# EAGLE design BlinkyBoard (EAGLE 7.5.0)
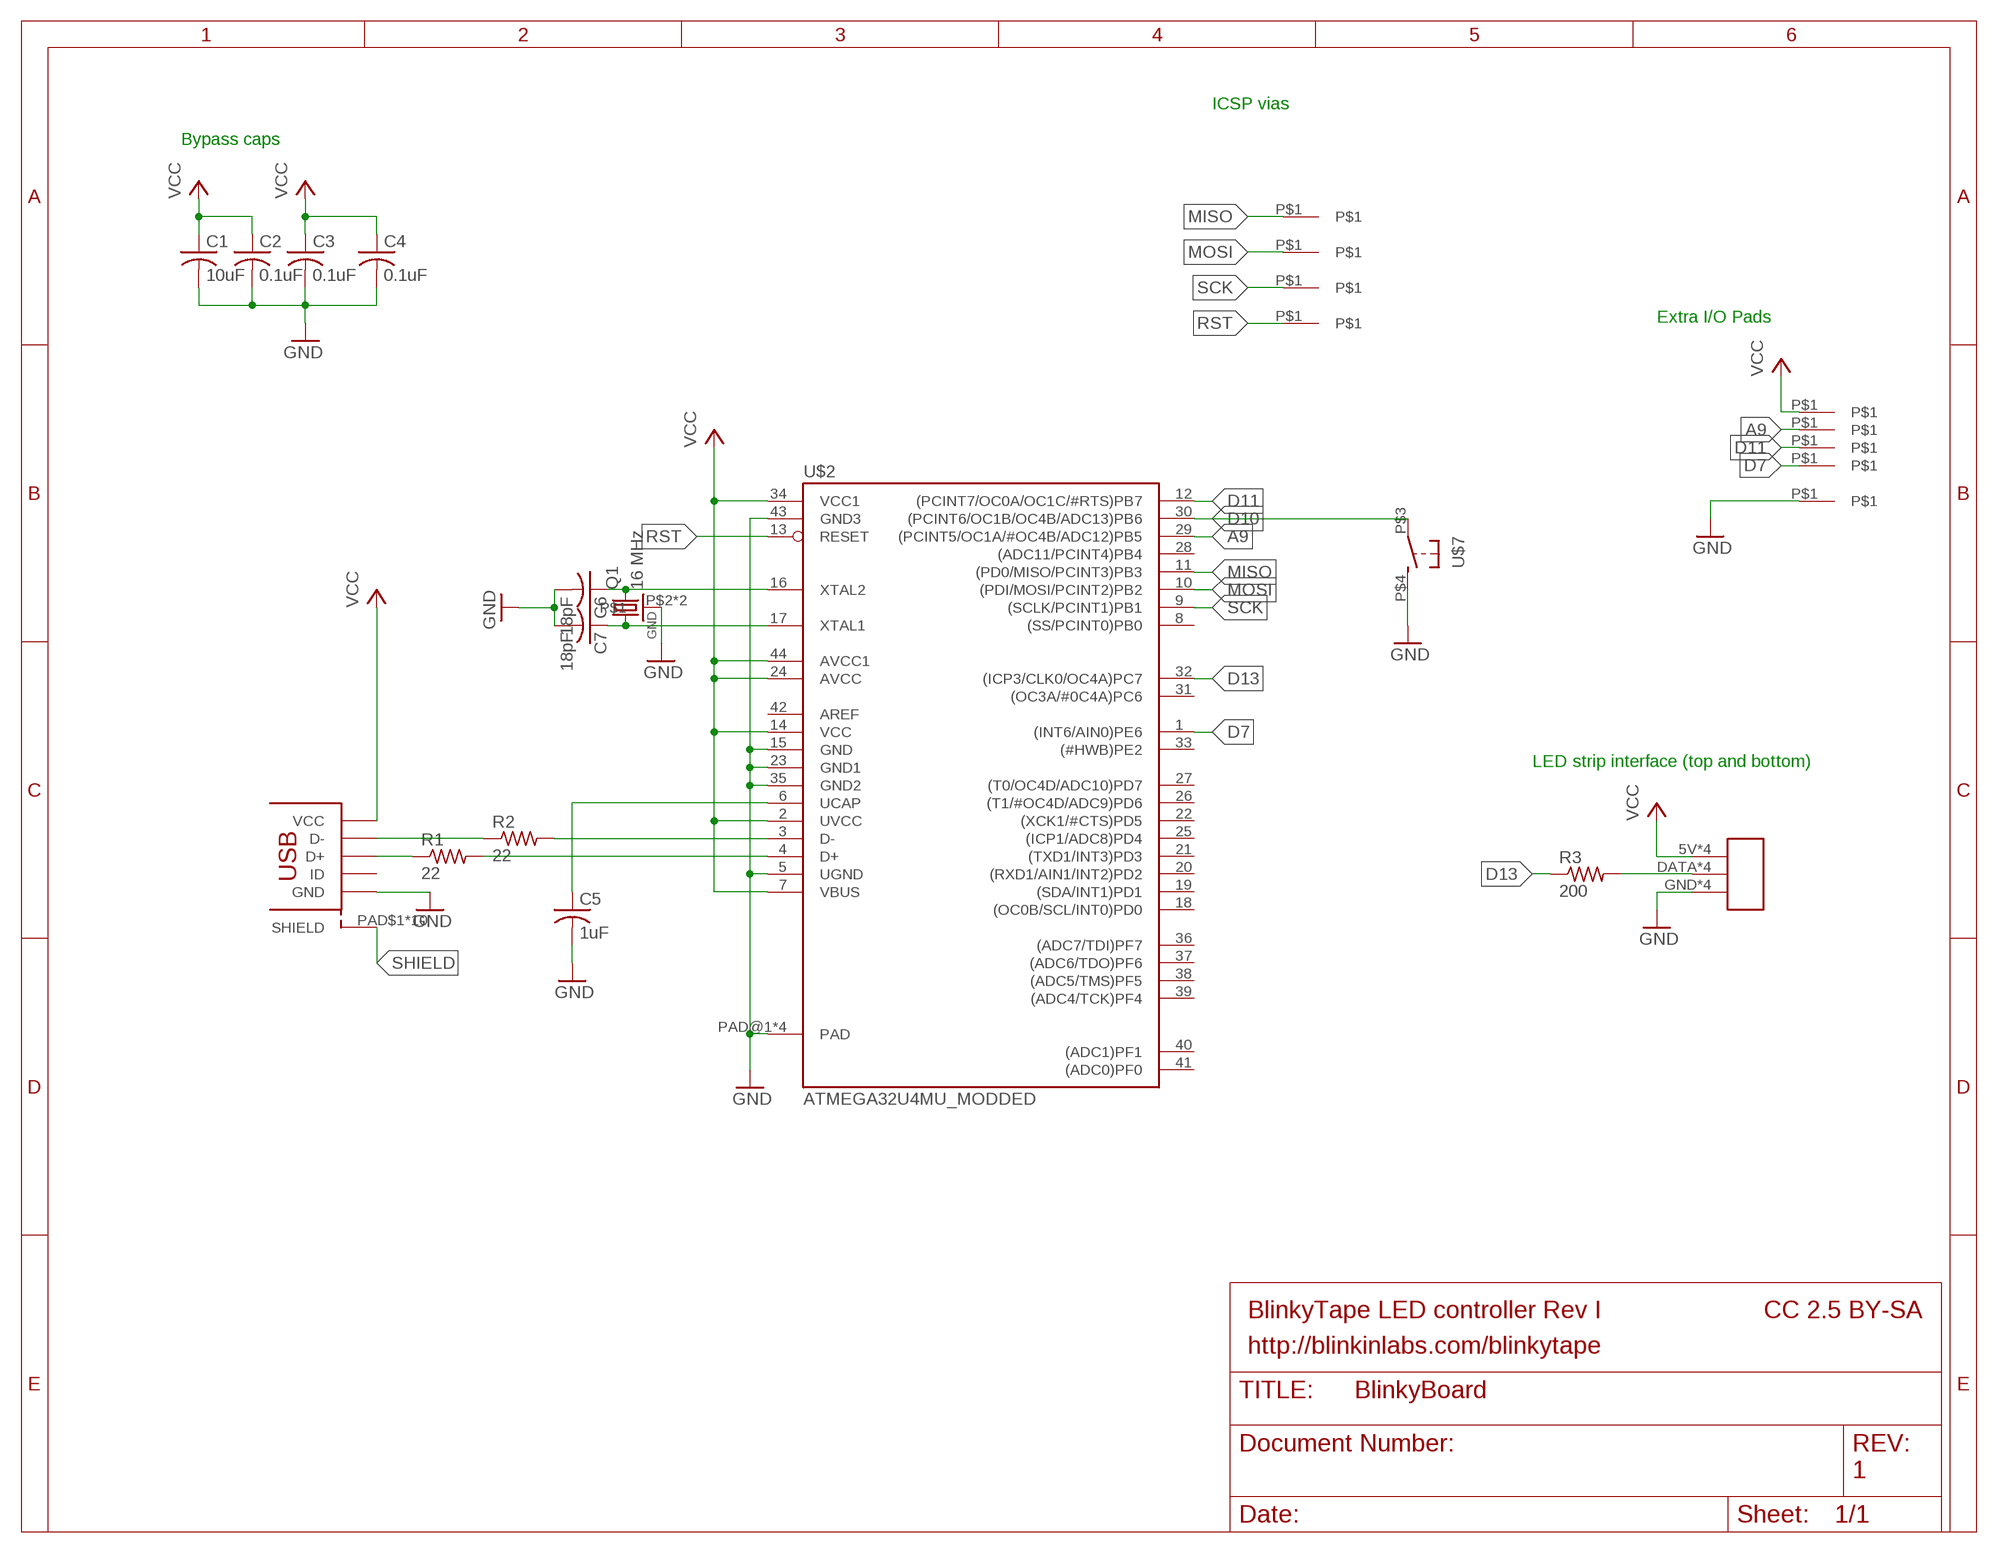
[diagram p0: schematic, sheet 1]

## Parts
C1  10uF  C-USC0603K  [C0603K]
C2  0.1uF  C_US  [CAP_0402_KEMET_MEDIAN]
C3  0.1uF  C_US  [CAP_0402_KEMET_MEDIAN]
C4  0.1uF  C_US  [CAP_0402_KEMET_MEDIAN]
C5  1uF  C_US  [CAP_0402_KEMET_MEDIAN]
C6  18pF  C_US  [CAP_0402_KEMET_MEDIAN]
C7  18pF  C_US  [CAP_0402_KEMET_MEDIAN]
Q1  16 MHz  CRYSTAL_4PAD2520  [CRSYTAL_2520]
R1  22  R_US  [RES_0402_KEMET_MEDIAN]
R2  22  R_US  [RES_0402_KEMET_MEDIAN]
R3  200  R_US  [RES_0402_KEMET_MEDIAN]
U$1  TEST_PAD_SMT  [TEST_PAD_1MM]
U$2  ATMEGA32U4MU_MODDED  [QFN44ML_7X7_LONGLEADS_MOD]
U$3  TEST_PAD_SMT  [TEST_PAD_1MM]
U$4  USB_MICROSMT+THRUHULE  [USB_MICRO_THRUHOLE]
U$5  TEST_PAD_SMT  [TEST_PAD_1MM]
U$6  TEST_PAD_SMT  [TEST_PAD_1MM]
U$7  BUTTON_MOMENTARY  [BUTTON_2P_SMD]
U$9  WS2812B_CONNECTOR  [WS2812B_CONNECTOR]
U$10  TEST_PAD_SMT  [TEST_PAD_SMT]
U$11  TEST_PAD_SMT  [TEST_PAD_SMT]
U$12  TEST_PAD_SMT  [TEST_PAD_SMT]
U$13  TEST_PAD_SMT  [TEST_PAD_SMT]
U$14  TEST_PAD_SMT  [TEST_PAD_SMT]

## Nets
A9: U$2.29((PCINT5/OC1A/#OC4B/ADC12)PB5) U$11.P$1
D7: U$2.1((INT6/AIN0)PE6) U$10.P$1
D10: U$2.30((PCINT6/OC1B/OC4B/ADC13)PB6) U$7.P$3(P)
D11: U$2.12((PCINT7/OC0A/OC1C/#RTS)PB7) U$14.P$1
D13: R3.P$1 U$2.32((ICP3/CLK0/OC4A)PC7)
D+: R1.P$2 U$2.4(D+)
D+_IN: R1.P$1 U$4.PIN$3(D+)
D-: R2.P$2 U$2.3(D-)
D-_IN: R2.P$1 U$4.PIN$2(D-)
GND [power]: C1.2 C2.P$2 C3.P$2 C4.P$2 C5.P$2 C6.P$2 C7.P$2 Q1.P$2 Q1.P$4 U$2.5(UGND) U$2.15(GND) U$2.23(GND1) U$2.35(GND2) U$2.43(GND3) U$2.PAD@1(PAD) U$2.PAD@4(PAD) U$2.PAD@13(PAD) U$2.PAD@16(PAD) U$4.PIN$5(GND) U$7.P$4(S) U$9.GND U$9.GND1(GND) U$9.GND_1(GND) U$9.GND_2(GND) U$13.P$1
LED_DATA: R3.P$2 U$9.DATA U$9.DATA1(DATA) U$9.DATA_1(DATA) U$9.DATA_2(DATA)
MISO: U$1.P$1 U$2.11((PD0/MISO/PCINT3)PB3)
MOSI: U$2.10((PDI/MOSI/PCINT2)PB2) U$3.P$1
N$2: C5.P$1 U$2.6(UCAP)
N$8: C6.P$1 Q1.P$3 U$2.16(XTAL2)
N$9: C7.P$1 Q1.P$1 U$2.17(XTAL1)
RST: U$2.13(RESET) U$6.P$1
SCK: U$2.9((SCLK/PCINT1)PB1) U$5.P$1
SHIELD: U$4.PAD$1(SHIELD) U$4.PAD$2(SHIELD) U$4.PAD$3(SHIELD) U$4.PAD$4(SHIELD) U$4.PAD$5(SHIELD) U$4.PAD$6(SHIELD) U$4.PAD$7(SHIELD) U$4.PAD$8(SHIELD) U$4.PAD$9(SHIELD) U$4.PAD$10(SHIELD)
VCC [power]: C1.1 C2.P$1 C3.P$1 C4.P$1 U$2.2(UVCC) U$2.7(VBUS) U$2.14(VCC) U$2.24(AVCC) U$2.34(VCC1) U$2.44(AVCC1) U$4.PIN$1(VCC) U$9.5V U$9.5V1(5V) U$9.5V_1(5V) U$9.5V_2(5V) U$12.P$1
Unconnected: U$2.8((SS/PCINT0)PB0) U$2.18((OC0B/SCL/INT0)PD0) U$2.19((SDA/INT1)PD1) U$2.20((RXD1/AIN1/INT2)PD2) U$2.21((TXD1/INT3)PD3) U$2.22((XCK1/#CTS)PD5) U$2.25((ICP1/ADC8)PD4) U$2.26((T1/#OC4D/ADC9)PD6) U$2.27((T0/OC4D/ADC10)PD7) U$2.28((ADC11/PCINT4)PB4) U$2.31((OC3A/#0C4A)PC6) U$2.33((#HWB)PE2) U$2.36((ADC7/TDI)PF7) U$2.37((ADC6/TDO)PF6) U$2.38((ADC5/TMS)PF5) U$2.39((ADC4/TCK)PF4) U$2.40((ADC1)PF1) U$2.41((ADC0)PF0) U$4.PIN$4(ID)

## Notes on the sheet
- ICSP vias
- Bypass caps
- Extra I/O Pads
- LED strip interface (top and bottom)
- BlinkyTape LED controller Rev I | CC 2.5 BY-SA
- http://blinkinlabs.com/blinkytape
- 1

## Power pins joined to a net without a drawn wire
AREF: U$2.42(AREF)

## Library data of the parts
C1 = adafruit:C-US: CAPACITOR, American symbol
C2-C7 = blinkiverse:C_US
Q1 = blinkinlabs:CRYSTAL_4PAD
R1-R3 = blinkiverse:R_US
U$1 U$3 U$5 U$6 = blinkinlabs:TEST_PAD_SMT
U$2 = blinkinlabs:ATMEGA32U4
U$4 = blinkinlabs:USB_MICRO
U$7 = blinkinlabs:BUTTON_MOMENTARY
U$9 = blinkiverse:WS2812B_CONNECTOR
U$10-U$14 = blinkiverse:TEST_PAD_SMT

## Net classes
0 data: width 0.2 mm, drill 0.3 mm, clearance 0.2 mm
1 power: width 0.24 mm, drill 0.3 mm, clearance 0.2 mm

## Board
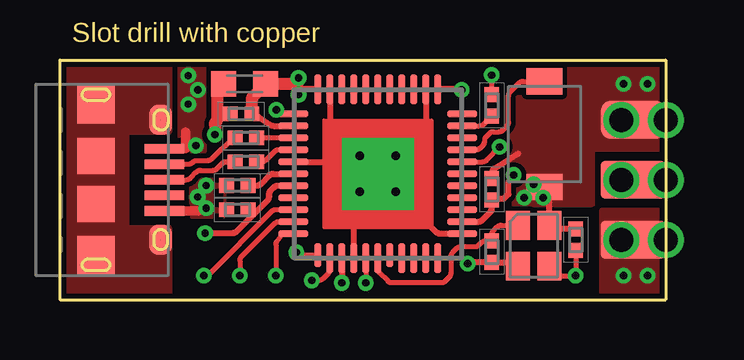
[diagram p1: board, top side]
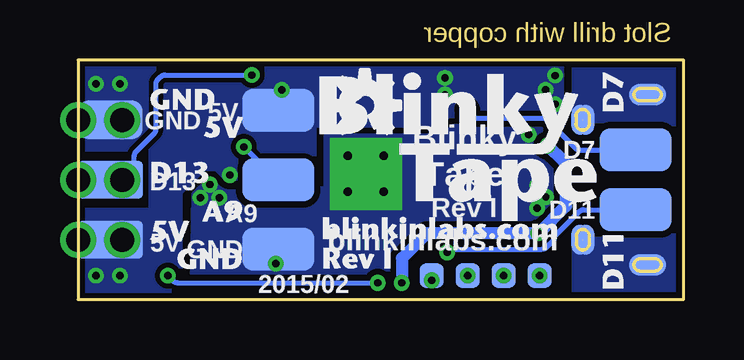
[diagram p2: board, bottom side, seen from below]

Size 25.25 x 10 mm. Coordinates in mm from the lower left corner, seen from the top.
Outline: 0,0 0,10 25.25,10 25.25,0 0,0
Copper layers (1*16): Top 0.0356mm / dielectric 1.5011mm / Bottom 0.0356mm
Design rules "BlinkyTape *": minimum track width 0.2mm, minimum drill 0.3mm, track to track 0.2mm, track to pad 0.2mm, pad to pad 0.2mm, via to via 0.2mm, smd to smd 0.2mm, copper to edge 8mil, drill to drill 0.25mm, minimum pad ring 7mil, minimum via ring 7mil, stop-mask expansion 2mil, vias tented up to drill 0.3mm, thermal gap 10mil

### Footprints (pad centres in the part's own frame; a part is rotated, then mirrored left to right if it is on the bottom)
C0603K = smd 1.05 x 1.08: 1 -0.875,0; 2 0.875,0
CAP_0402_KEMET_MEDIAN = smd 0.62 x 0.62: P$1 -0.45,0; P$2 0.45,0
CRSYTAL_2520 = smd 1.2 x 1: P$1 -0.85,-0.65; P$2 0.85,-0.65; P$3 0.85,0.65; P$4 -0.85,0.65
RES_0402_KEMET_MEDIAN = smd 0.62 x 0.62: P$1 -0.45,0; P$2 0.45,0
TEST_PAD_1MM = smd 1 x 1: P$1 0,0
QFN44ML_7X7_LONGLEADS_MOD = smd 1.25 x 0.275: 1 -3.525,2.5; 2 -3.525,2; 3 -3.525,1.5; 4 -3.525,1; 5 -3.525,0.5; 6 -3.525,0; 7 -3.525,-0.5; 8 -3.525,-1; 9 -3.525,-1.5; 10 -3.525,-2; 11 -3.525,-2.5; 23 3.525,-2.5; 24 3.525,-2; 25 3.525,-1.5; 26 3.525,-1; 27 3.525,-0.5; 28 3.525,0; 29 3.525,0.5; 30 3.525,1; 31 3.525,1.5; 32 3.525,2; 33 3.525,2.5 | smd 0.275 x 1: 12 -2.5,-3.4; 18 0.5,-3.4 | smd 0.275 x 1.25: 13 -2,-3.525; 14 -1.5,-3.525; 15 -1,-3.525; 16 -0.5,-3.525; 17 0,-3.525; 19 1,-3.525; 20 1.5,-3.525; 21 2,-3.525; 22 2.5,-3.525; 34 2.5,3.525; 35 2,3.525; 36 1.5,3.525; 37 1,3.525; 38 0.5,3.525; 39 0,3.525; 40 -0.5,3.525; 41 -1,3.525; 42 -1.5,3.525; 43 -2,3.525; 44 -2.5,3.525 | drill 0.35 pad 1.5 square: PAD@1 -0.75,0.75; PAD@4 0.75,0.75; PAD@13 -0.75,-0.75; PAD@16 0.75,-0.75
USB_MICRO_THRUHOLE = smd 1.645 x 1.55: PAD$1 -3.172,0; PAD$4 3.172,0 | smd 1.5 x 1.55: PAD$2 -1,0; PAD$3 1,0 | smd 1.25 x 0.95: PAD$5 -2.5,2.7; PAD$6 2.5,2.7 | smd 0.9 x 1.55 bottom: PAD$7 -3.55,0; PAD$8 3.55,0 | smd 1.25 x 0.95 bottom: PAD$9 -2.5,2.7; PAD$10 2.5,2.7 | smd 0.4 x 1.65: PIN$1 -1.3,2.85; PIN$2 -0.65,2.85; PIN$3 0,2.85; PIN$4 0.65,2.85; PIN$5 1.3,2.85
BUTTON_2P_SMD = smd 1.1 x 1.5: P$3 -2.2,0; P$4 2.2,0
WS2812B_CONNECTOR = smd 2.7 x 1.6 bottom: 5V 0,2.5; DATA1 0,0; GND1 0,-2.5 | smd 2.7 x 1.6: 5V1 0,2.5; DATA 0,0; GND 0,-2.5 | drill 1: 5V_1 1.35,2.5; 5V_2 -0.5,2.5 | drill 1 pad 1.5: DATA_1 1.35,0; DATA_2 -0.5,0; GND_1 1.35,-2.5; GND_2 -0.5,-2.5
TEST_PAD_SMT = smd 1.8 x 3: P$1 0,0

### Placement (x,y rotation side)
C1  7.7,9 180 top
C2  7.55,7.75 180 top
C3  7.4,3.75 180 top
C4  18,4.6 90 top
C5  7.4,4.76 180 top
C6  21.5,2.5 90 top
C7  18,2 270 top
Q1  19.75,2.25 270 top
R1  7.75,5.75 0 top
R2  7.75,6.75 0 top
R3  18,8.1 90 top
U$1  9,1 0 bottom
U$2  13.25,5.25 0 top
U$3  7.5,1 0 bottom
U$4  1.5,5 270 top
U$5  6,1 0 bottom
U$6  10.5,1 0 bottom
U$7  20.2,6.9 270 top
U$9  23.9,5 180 bottom
U$10  2,6.25 90 bottom
U$11  16.9,5 90 bottom
U$12  16.9,7.9 270 bottom
U$13  16.9,2.1 270 bottom
U$14  2,3.75 270 bottom
U$15  [OSHW-LOGO-S]  13.29,8.1 0 bottom

### Tracks (layer width: path | path; a pad name or v marks a point on that pad's centre or on a via)
A9  (via drill 0.3)
  Top 0.2: U$2.29 17.61,5.75 arc45 17.79,5.83 v18.33,6.37
  Bottom 0.2: U$11.P$1 16.97,5 v18.33,6.37
D7  (via drill 0.3)
  Top 0.2: U$2.1 9.29,7.75 v9.02,7.92
  Bottom 0.2: v9.02,7.92 8.85,7.67 arc-54 8.64,7.57 5.86,7.57 arc45 5.69,7.5 4.51,6.32 arc-45 4.34,6.25 U$10.P$1
D10
  Top 0.2: U$2.30 17.35,6.25 arc45 17.52,6.32 17.63,6.43 arc45 17.7,6.6 17.7,6.63 arc-45 17.77,6.8 17.9,6.93 arc-45 18.07,7 18.3,7 arc45 18.47,7.07 18.63,7.23 arc45 18.7,7.4 18.7,8.5 arc-45 18.77,8.67 19.13,9.03 arc-45 19.3,9.1 U$7.P$3
D11  (via drill 0.3)
  Top 0.2: U$2.12 10.07,1.85 arc-50 9.88,1.94 v9.85,1.97
  Bottom 0.2: U$14.P$1 4.17,3.75 arc-45 4.34,3.68 5.33,2.69 arc-45 5.4,2.52 arc45 5.41,2.49 5.73,2.17 arc45 5.9,2.1 9.6,2.1 arc-45 9.77,2.03 v9.85,1.97
D13
  Top 0.2: U$2.32 17.5,7.25 arc45 17.67,7.32 R3.P$1
D+
  Top 0.2: U$2.4 9.12,6.25 arc45 8.95,6.18 8.59,5.82 arc-45 8.42,5.75 R1.P$2
D+_IN
  Top 0.2: U$4.PIN$3 5.27,5 arc45 5.44,5.07 5.69,5.32 arc-45 5.86,5.39 6.37,5.39 arc45 6.54,5.46 6.76,5.68 arc-45 6.93,5.75 R1.P$1
D-
  Top 0.2: U$2.3 R2.P$2
D-_IN
  Top 0.2: 7.25,6.75 7.22,6.75 | U$4.PIN$2 5.35,5.65 arc45 5.52,5.72 5.53,5.73 arc-45 5.7,5.8 6.15,5.8 arc45 6.32,5.87 6.75,6.3 7.2,6.7 7.25,6.75 | 7.25,6.75 R2.P$1
GND  (via drill 0.3)
  Top 0.24: U$2.23 15.85,2.75 arc-45 15.68,2.82 15.2,3.3 | C6.P$2 20.55,2.95 Q1.P$4 20.4,4.23 v20.15,4.25 | C4.P$2 18.01,5.27 arc-56 18.12,5.47 19.1,6.09
  Top 0.254: U$2.5 12.25,5.75 | U$2.15 12.25,3.14 | U$2.43 11.25,7.16 | U$2.35 15.25,7.26 | v17,1.5 17.05,1.55 C7.P$2 18.95,1.55 Q1.P$2 | C6.P$2 21.5,3
  Top 0.4: U$4.PIN$5 5.75,3.7
  Top 0.5: C1.2 6.56,8.73 6.56,7.7 | 6.56,7.7 6.56,7.57 arc-45 6.5,7.42 6.5,7.4 arc45 6.46,7.3 v6.46,6.89 | C2.P$2 7.05,7.7 6.56,7.7
  other vias: 19.35,4.25 6.09,4.76 6.1,3.81 19.75,4.8 5.74,4.28 24.5,9 23.5,9
  pour Bottom (isolate 0.254): 5.05,7.2 9.6,7.2 10,6.8 14.9,6.8 14.9,4.6 19.33,4.6 19.73,5 19.8,5 20.4,4.4 20.5,0 5.05,0
  pour Top: 6.8,3.5 5.5,3.5 5.5,5 6.8,5
  pour Top: 15.4,3.1 15.4,7.4 11.1,7.4 11.1,3.1
  pour Top: 25.3,10 18.7,10 18.7,4 22.2,4 22.2,6.3 25.3,6.3
  pour Bottom: 25,10 25.2,10 25.2,6.3 21.9,6.3 21.9,10
LED_DATA  (via drill 0.3)  (1 unrouted)
  Top 0.2: R3.P$2 v18,9.37
  Bottom 0.2: v18,9.37 21.63,9.37 arc-45 21.8,9.3 21.93,9.17 arc-45 22,9 22,7.1 arc45 22.07,6.93 22.83,6.17 arc-45 22.9,6 22.9,5 U$9.DATA_2
  Bottom 0.406: U$9.DATA_1 U$9.DATA U$9.DATA_2
MISO  (via drill 0.3)
  Top 0.2: U$2.11 9.28,2.75 9.05,2.44 arc36 9,2.29 U$1.P$1
  other vias: 9,1
MOSI  (via drill 0.3)
  Top 0.2: U$2.10 9.13,3.25 arc45 8.96,3.18 7.57,1.79 arc45 7.5,1.62 U$3.P$1
  other vias: 7.5,1
N$2
  Top 0.24: C5.P$1 8.19,4.75 arc46 8.38,4.83 8.73,5.18 arc-45 8.9,5.25 U$2.6
N$8  (via drill 0.3)
  Top 0.2: U$2.16 v12.75,0.7 | C6.P$1 v21.5,1 20.8,1 Q1.P$3
  Bottom 0.2: v21.5,1 21.27,0.77 arc-45 21.1,0.7 v12.75,0.7
N$9
  Top 0.2: Q1.P$1 18.4,3.1 arc45 18.23,3.03 18.07,2.87 arc45 18,2.7 C7.P$1 17.75,2.45 arc45 17.58,2.38 17.47,2.27 arc-45 17.3,2.2 16.7,2.2 arc45 16.53,2.13 16.37,1.97 arc45 16.3,1.8 16.3,1.1 arc-45 16.23,0.93 16.07,0.77 arc-45 15.9,0.7 13.84,0.7 arc-45 13.67,0.77 13.32,1.12 arc-45 13.25,1.29 U$2.17
RST  (via drill 0.3)
  Top 0.2: U$2.13 11.25,1.25 arc-45 11.18,1.08 10.97,0.87 arc-45 10.8,0.8 v10.5,0.8
  Bottom 0.2: v10.5,0.8 U$6.P$1
SCK  (via drill 0.3)
  Top 0.2: U$2.9 9,3.75 arc45 8.83,3.68 6.15,1 U$5.P$1
  other vias: 6,1
SHIELD  (2 unrouted)
  pour Top: 0.05,10 4.55,10 4.55,7 2.75,7 2.75,3 4.55,3 4.55,0 0.05,0
  pour Bottom (isolate 0.254): 0.05,10 4.55,10 4.55,7.5 2.75,7.5 2.75,2.5 4.55,2.5 4.55,0 0.05,0
VCC  (via drill 0.3)
  Top 0.24: U$2.7 9.08,4.75 arc45 8.91,4.68 8.79,4.56 arc45 8.72,4.39 8.72,4.3 arc-45 8.65,4.13 8.27,3.75 | C3.P$1 8.27,3.75 | 8.27,3.75 7.36,2.84 arc-45 7.19,2.77 v6.05,2.77 | U$2.44 10.18,8.78 v9.95,8.55 | C2.P$1 8.23,7.65 arc-11 8.27,7.63 8.76,7.29 arc34 8.9,7.25 U$2.2 | U$2.24 17.45,3.25 arc45 17.62,3.32 17.93,3.63 arc45 18,3.8 C4.P$1 18,4.21 18.51,4.21 18.7,4.4 18.7,4.9 v18.92,5.2
  Top 0.254: v16.75,8.75 16.5,8.78 U$2.34 | U$2.14 v11.75,0.7 | U$2.2 9.7,7.25
  Top 0.4: U$4.PIN$1 5.23,6.3 5.23,7
  Top 0.5: v9.95,8.55 9.9,8.6 9.9,9.2 9.7,9 C1.1 | C1.1 8.3,8.72 | C2.P$1 8,8.32 arc-45 8.07,8.5 C1.1
  Bottom 0.5: v5.67,6.43 4.97,5.73 arc45 4.9,5.56 4.9,3.9 6.03,2.77 v6.05,2.77 10.71,2.77 U$2.14 v11.75,0.7
  other vias: 5.35,9.35 5.75,8.75 9.95,9.25 5.35,8.15 23.5,1 24.5,1
  pour Bottom: 5.1,10 22.2,10 22.2,3.7 25.3,3.7 25.3,0 21,0 21,4.5 20,5.5 19.5,5.5 19.1,5.1 15.4,5.1 15.4,7.3 10.2,7.3 9.8,7.7 5.1,7.7
  pour Top: 5,10 5,6.2 6,6.2 6,10
  pour Top: 25.2,0 25.3,0 25.3,3.7 22.6,3.7 22.6,0

### Text on the board
bNames: GND | 5V | D7 | Blinky / Tape | D13 | D11 | Rev I | A9 | 5V | blinkinlabs.com | GND | 2015/02
Milling: Slot drill with copper